# Altium schematic sheet pca10031_misc.SchDoc: PCA10031 - Miscellaneous Components and Interfaces
size A4; Revision: 1.1.0; SheetNumber: 3; SheetTotal: 3; DrawnBy: RUBR; ProjectNumber: 4403; PCBRevision: 0168RUBR; DocumentSize: A4; PCAName: PCA10031; PCBNumber: 400101; ProjectName: Cost optimized nRF51-EK
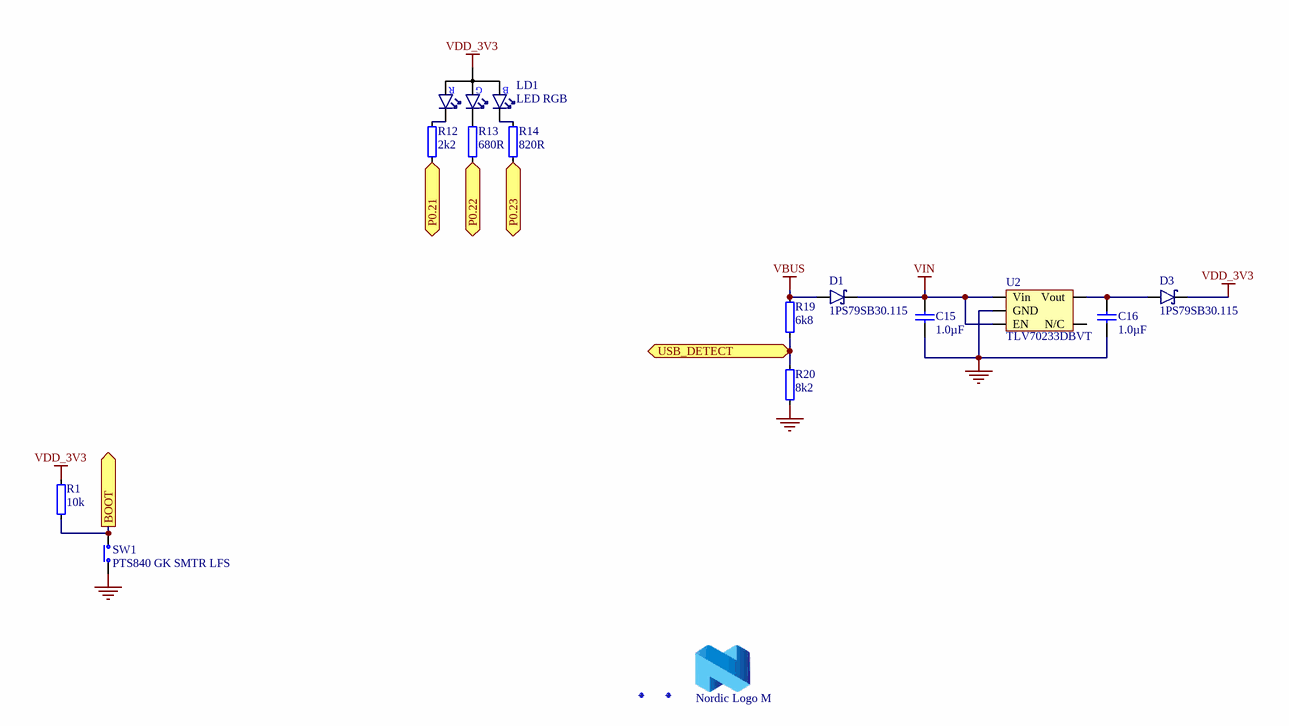
[diagram p0: pca10031_misc.SchDoc]

## Parts
C15  1.0µF  [CAPC1608X06L]
C16  1.0µF  [CAPC1608X06L]
D1  1PS79SB30.115  [SOD-523]
D3  1PS79SB30.115  [SOD-523]
Fid1  Fiducial mark  [Fiducial]  (value not drawn)
Fid2  Fiducial mark  [Fiducial]  (value not drawn)
LD1  LED RGB  [SML-LX0404SIUPGUSB]
LOGO1  Nordic Logo M  [NORDIC_LOGO_M]  (no BOM)
R1  10k  [RESC1005X04L]
R12  2k2  [RESC1005X04L]
R13  680R  [RESC1005X04L]
R14  820R  [RESC1005X04L]
R19  6k8  [RESC1005X04L]
R20  8k2  [RESC1005X04L]
SW1  PTS840 GK SMTR LFS  [EVQP7A/J/B/K]
U2  TLV70233DBVT  [SOT-23-5]

## Ports
BOOT (out), P0.21 (bidir), P0.22 (bidir), P0.23 (bidir), USB_DETECT (bidir)

## Nets
GND: C15.1 C16.1 R20.2 SW1.2(COM) U2.2(GND)
VBUS: D1.1(A) R19.1
VDD_3V3: D3.3(C) LD1.4(A) R1.2
VIN: C15.2 D1.3(C) U2.1(Vin) U2.3(EN)
BOOT: R1.1 SW1.1(N.O) ; port BOOT
P0.21: R12.1 ; port P0.21
P0.22: R13.1 ; port P0.22
P0.23: R14.1 ; port P0.23
USB_DETECT: R19.2 R20.1 ; port USB_DETECT
NetC16_2: C16.2 D3.1(A) U2.5(Vout)
NetLD1_1: LD1.1(C_RED) R12.2
NetLD1_2: LD1.2(C_GREEN) R13.2
NetLD1_3: LD1.3(C_BLUE) R14.2

Not connected (* = marked no-connect by the designer): U2 4(N/C)

## Notes on the sheet
- Title
- Size
- Date:
- Project Number
- Sheet         of
- Revision
- File:
- Drawn By:
- (in symbol SML-LX0404SIUPGUSB) R; G; B

## Library data of the parts
C15 C16 = C0603-1µ0: Capacitor, X7R, ±10%; Note: 16V; Artikkelnr Noca: 20039335; Artikkelnr Simpro: N.A.; Published: 2009-05-08; LatestRevisionDate: 2013-06-05; Publisher: Nordic Semiconductor; Value: 1.0µF; Part Number: C0603-1µ0; Manufacturer: *; Manufacturer Part Number: *; Datasheet: *; Pin Count: 2; Supplier: *; Supplier part number: *; 2nd source Supplier: *; 2nd source part number: *; Footprint Doc: 0603
D1 D3 = 1PS79SB30.115: Diode Schottky Vf=0.38, Vr=40V, If=200mA, Ir=500nA; Manufacturer: NXP; Artikkelnr Noca: N.A.; Part Number: 1PS79SB30.115; Manufacturer Part Number: 1PS79SB30.115; Datasheet: http://www.nxp.com/documents/data_sheet/1PS79SB30.pdf; Footprint Doc: SOD-523; LatestRevisionDate: 2014-09-24; Pin Count: 2; Publisher: Nordic Semiconductor; Published: 2014-09-24; Value: 1PS79SB30.115; Note: *; Supplier: Digi-Key; Supplier part number: 568-5973-1-ND; 2nd source Supplier: *; 2nd source part number: *; Artikkelnr Simpro: N.A.
Fid1 Fid2 = Fid-Mark: Artikkelnr Noca: N.A.; Part Number: Fid-Mark; Manufacturer: *; Manufacturer Part Number: *; Datasheet: *; LatestRevisionDate: 2009-12-12; Pin Count: 1; Publisher: Nordic Semiconductor; Published: 2009-12-12; Value: *; Note: *; Supplier: *; Supplier part number: *; 2nd source Supplier: *; 2nd source part number: *; Footprint Doc: Fiducial; Artikkelnr Simpro: N.A.
LD1 = SML-LX0404SIUPGUSB: RGB LED 1.00 mm x 1.00 mm SMD; Manufacturer: Lumex; 2nd source part number: 211-8843; Artikkelnr Noca: 13019150; Artikkelnr Simpro: N.A.; Part Number: SML-LX0404SIUPGUSB; Manufacturer Part Number: SML-LX0404SIUPGUSB; Datasheet: http://media.digikey.com/pdf/Data%20Sheets/Lumex%20PDFs/SML-LX0404SIUPGUSB.pdf; LatestRevisionDate: 2012-10-08; Pin Count: 4; Publisher: Nordic Semiconductor; Published: 2012-10-08; Value: LED RGB; Note: *; Supplier: Digi-Key; Supplier part number: 67-2125-1-ND; 2nd source Supplier: Farnell; Footprint Doc: SML-LX0404SIUPGUSB
LOGO1 = Nordic Logo M: Nordic Logo, medium size; Artikkelnr Noca: N.A.; Part Number: Nordic Logo M; Manufacturer: *; Manufacturer Part Number: *; Datasheet: *; LatestRevisionDate: 2010-02-18; Publisher: Nordic Semiconductor; Value: Nordic Logo M; Note: *; Supplier: *; Supplier part number: *; 2nd source Supplier: *; 2nd source part number: *; Pin Count: 2; Published: 2010-02-18; Footprint Doc: NORDIC_LOGO_M; Artikkelnr Simpro: N.A.
R1 = R0402-10k: Resistor, ±1%, 0.063W; Note: Chip Res 1%; Artikkelnr Noca: 27049097; Artikkelnr Simpro: N.A.; Part Number: R0402-10k; Manufacturer: *; Manufacturer Part Number: *; Datasheet: *; LatestRevisionDate: 2009-11-23; Pin Count: 2; Publisher: Nordic Semiconductor; Published: 2009-05-08; Value: 10k; Supplier: Farnell; Supplier part number: 173-8864; 2nd source Supplier: *; 2nd source part number: *; Footprint Doc: 0402
R12 = R0402-2k2: Resistor, ±1%, 0.063W; Note: Chip Res 1%; Artikkelnr Noca: 27049081; Artikkelnr Simpro: N.A.; Part Number: R0402-2k2; Manufacturer: *; Manufacturer Part Number: *; Datasheet: *; LatestRevisionDate: 2009-11-23; Pin Count: 2; Publisher: Nordic Semiconductor; Published: 2009-05-08; Value: 2k2; Supplier: Farnell; Supplier part number: 173-8854; 2nd source Supplier: *; 2nd source part number: *; Footprint Doc: 0402
R13 = R0402-680: Resistor, ±1%, 0.063W; Note: Chip Res 1%; Artikkelnr Noca: 27049069; Artikkelnr Simpro: N.A.; Part Number: R0402-680; Manufacturer: *; Manufacturer Part Number: *; Datasheet: *; LatestRevisionDate: 2009-11-23; Pin Count: 2; Publisher: Nordic Semiconductor; Published: 2009-05-08; Value: 680R; Supplier: Farnell; Supplier part number: 173-8848; 2nd source Supplier: *; 2nd source part number: *; Footprint Doc: 0402
R14 = R0402-820: Resistor, ±1%, 0.063W; Note: Chip Res 1%; Artikkelnr Noca: 27049071; Artikkelnr Simpro: N.A.; Part Number: R0402-820; Manufacturer: *; Manufacturer Part Number: *; Datasheet: *; LatestRevisionDate: 2009-11-23; Pin Count: 2; Publisher: Nordic Semiconductor; Published: 2009-05-08; Value: 820R; Supplier: Farnell; Supplier part number: 173-8849; 2nd source Supplier: *; 2nd source part number: *; Footprint Doc: 0402
R19 = R0402-6k8: Resistor, ±1%, 0.063W; Note: Chip Res 1%; Artikkelnr Noca: 27049093; Artikkelnr Simpro: N.A.; Part Number: R0402-6k8; Manufacturer: *; Manufacturer Part Number: *; Datasheet: *; LatestRevisionDate: 2009-11-23; Pin Count: 2; Publisher: Nordic Semiconductor; Published: 2009-05-08; Value: 6k8; Supplier: Farnell; Supplier part number: 173-8862; 2nd source Supplier: *; 2nd source part number: *; Footprint Doc: 0402
R20 = R0402-8k2: Resistor, ±1%, 0.063W; Note: Chip Res 1%; Artikkelnr Noca: 27049095; Artikkelnr Simpro: N.A.; Part Number: R0402-8k2; Manufacturer: *; Manufacturer Part Number: *; Datasheet: *; LatestRevisionDate: 2009-11-23; Pin Count: 2; Publisher: Nordic Semiconductor; Published: 2009-05-08; Value: 8k2; Supplier: Farnell; Supplier part number: 173-8863; 2nd source Supplier: *; 2nd source part number: *; Footprint Doc: 0402
SW1 = PTS840 GK SMTR LFS: Microminiature SMT Switch, Side Actuated; Manufacturer: C & K; 2nd source part number: 611-PTS840GKSMTR; Note: Tactile Switch, SPST, SMD, 220gf; Artikkelnr Noca: 50019089; Artikkelnr Simpro: N.A.; Part Number: PTS840 GK SMTR LFS; Manufacturer Part Number: PTS840 GK SMTR LFS; Datasheet: http://www.ck-components.com/80185/pts840_11june13.pdf/; LatestRevisionDate: 2014-09-17; Pin Count: 4; Publisher: Nordic Semiconductor; Published: 2014-08-12; Value: PTS840 GK SMTR LFS; Supplier: Digi-Key; Supplier part number: CKN10508CT-ND; 2nd source Supplier: Mouser; Footprint Doc: PTS840 Gx
U2 = TLV70233DBVT: IC REG LDO 3.3V 300MA SOT23-5; Manufacturer: Texas Instruments; Note: 300-mA, Low-IQ, Low-Dropout Regulator; Artikkelnr Noca: 17039215; Artikkelnr Simpro: N.A.; Part Number: TLV70233DBVT; Manufacturer Part Number: TLV70233DBVT; Datasheet: http://www.ti.com/lit/ds/symlink/tlv70218.pdf; LatestRevisionDate: 2012-07-06; Pin Count: 5; Publisher: Nordic Semiconductor; Published: 2012-07-06; Value: TLV70233DBVT; Supplier: Digi-Key; Supplier part number: 296-27895-1-ND; 2nd source Supplier: *; 2nd source part number: *; Footprint Doc: SOT-23-5